# Altium schematic sheet Peripherals.SchDoc
size A4; Revision: C.2
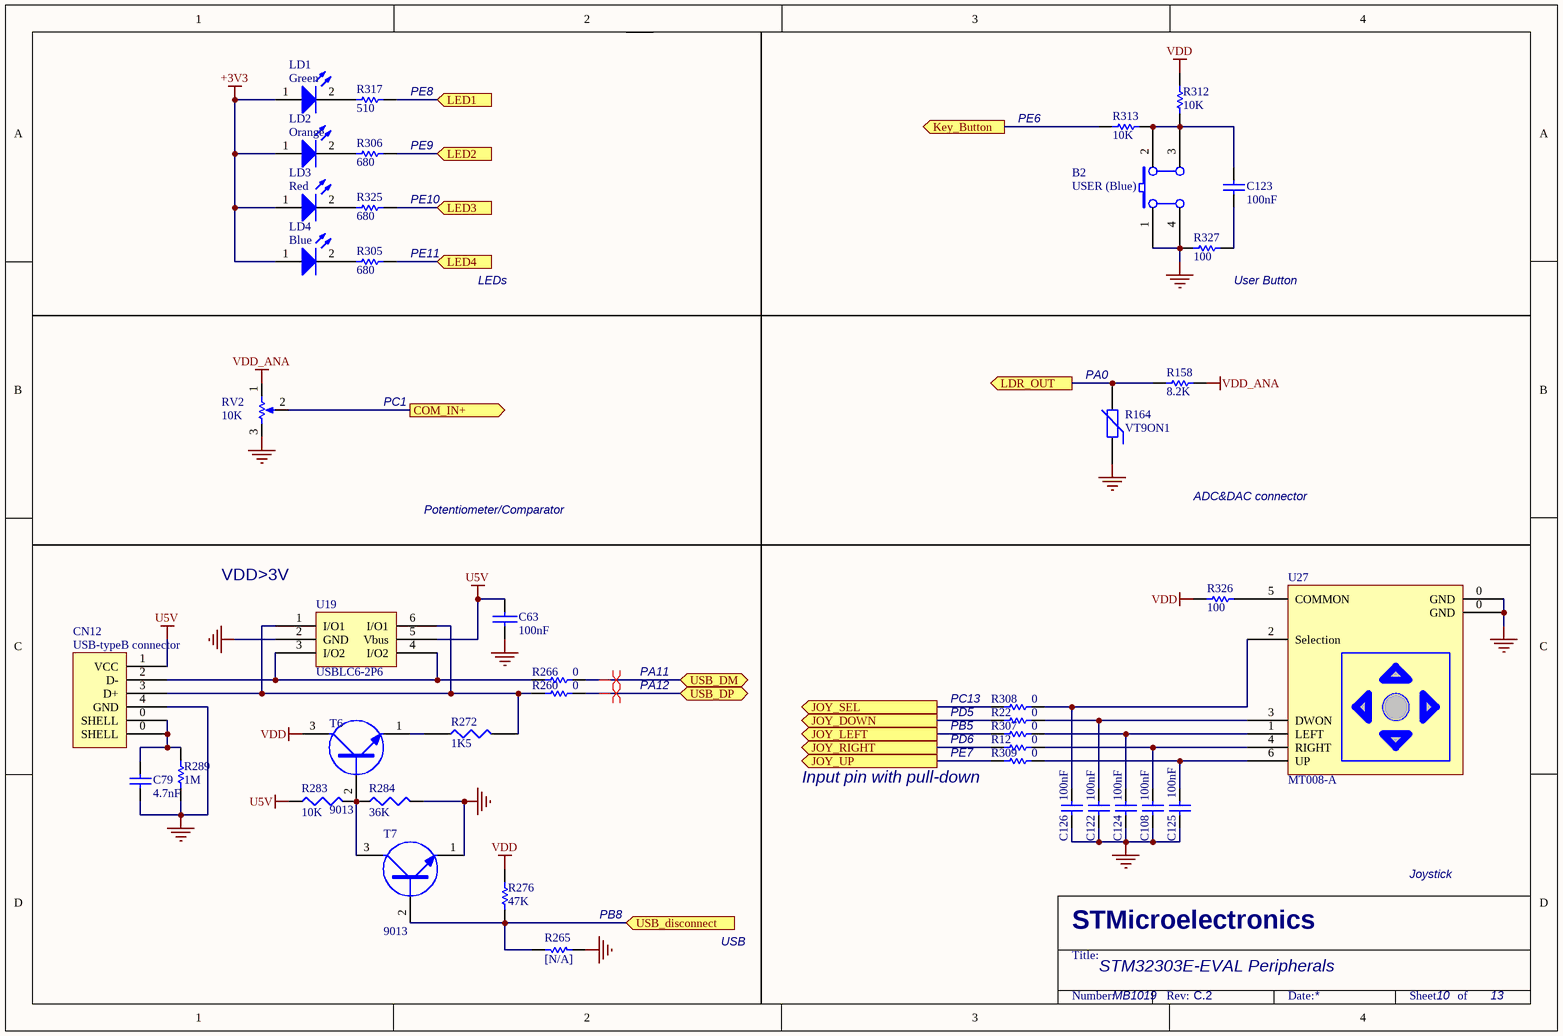
[diagram p0: Peripherals.SchDoc]

## Parts
B2  USER (Blue)  [PB10]
C63  100nF  [0603C]
C79  4.7nF  [0603C]
C108  100nF  [0603C]
C122  100nF  [0603C]
C123  100nF  [0603C]
C124  100nF  [0603C]
C125  100nF  [0603C]
C126  100nF  [0603C]
CN12  USB-typeB connector  [USB-B]
LD1  Green  [0603D]
LD2  Orange  [0603D]
LD3  Red  [0603D]
LD4  Blue  [0603D]
R12  0  [0603R]
R22  0  [0603R]
R158  8.2K  [0603R]
R164  VT9ON1  [PVT901]
R260  0  [0603R]
R265  [N/A]  [0603R]
R266  0  [0603R]
R272  1K5  [0603R]
R276  47K  [0603R]
R283  10K  [0603R]
R284  36K  [0603R]
R289  1M  [0603R]
R305  680  [0603R]
R306  680  [0603R]
R307  0  [0603R]
R308  0  [0603R]
R309  0  [0603R]
R312  10K  [0603R]
R313  10K  [0603R]
R317  510  [0603R]
R325  680  [0603R]
R326  100  [0603R]
R327  100  [0603R]
RV2  10K  [3296W]
T6  9013  [SOT-23]
T7  9013  [SOT-23]
U19  USBLC6-2P6  [SOT-666]
U27  MT008-A  [JOY]

## Ports
COM_IN+ (out), JOY_DOWN (out), JOY_LEFT (out), JOY_RIGHT (out), JOY_SEL (out), JOY_UP (out), Key_Button (out), LDR_OUT (out), LED1 (in), LED2 (in), LED3 (in), LED4 (in), USB_disconnect (in), USB_DM (bidir), USB_DP (bidir)

## Nets
+3V3: LD1.1(A) LD2.1(A) LD3.1(A) LD4.1(A)
GND: B2.1(A0) B2.4(A1) C63.2 C79.1 C108.1 C122.1 C124.1 C125.1 C126.1 CN12.4(GND) R164.1 R265.1 R284.2 R289.1 R327.1 RV2.3(TOP) T7.1(E) U19.2(GND) U27.0(GND)
U5V: C63.1 CN12.1(VCC) R283.1 U19.5(Vbus)
VDD: R276.2 R312.2 R326.1 T6.3(C)
VDD_ANA: R158.2 RV2.1(BOT)
COM_IN+: RV2.2(TAP) ; port COM_IN+
JOY_DOWN: R22.1 ; port JOY_DOWN
JOY_LEFT: R307.2 ; port JOY_LEFT
JOY_RIGHT: R12.1 ; port JOY_RIGHT
JOY_SEL: R308.2 ; port JOY_SEL
JOY_UP: R309.2 ; port JOY_UP
Key_Button: R313.2 ; port Key_Button
LDR_OUT: R158.1 R164.2 ; port LDR_OUT
LED1: R317.1 ; port LED1
LED2: R306.1 ; port LED2
LED3: R325.1 ; port LED3
LED4: R305.1 ; port LED4
USB_disconnect: R265.2 R276.1 T7.2(B) ; port USB_disconnect
USB_DM: R266.1 ; port USB_DM
USB_DP: R260.1 ; port USB_DP
NetB2_2: B2.2(B0) B2.3(B1) C123.2 R312.1 R313.1
NetC79_2: C79.2 CN12.0(SHELL) R289.2
NetC108_2: C108.2 R12.2 U27.4(RIGHT)
NetC122_2: C122.2 R22.2 U27.3(DWON)
NetC123_1: C123.1 R327.2
NetC124_2: C124.2 R307.1 U27.1(LEFT)
NetC125_2: C125.2 R309.1 U27.6(UP)
NetC126_2: C126.2 R308.1 U27.2(Selection)
NetCN12_2: CN12.2(D-) R266.2 U19.3(I/O2) U19.4(I/O2)
NetCN12_3: CN12.3(D+) R260.2 R272.2 U19.1(I/O1) U19.6(I/O1)
NetLD1_2: LD1.2(K) R317.2
NetLD2_2: LD2.2(K) R306.2
NetLD3_2: LD3.2(K) R325.2
NetLD4_2: LD4.2(K) R305.2
NetR272_1: R272.1 T6.1(E)
NetR283_2: R283.2 R284.1 T6.2(B) T7.3(C)
NetR326_2: R326.2 U27.5(COMMON)

## Layout directives
differential pair: USB_DM, USB_DP

## Notes on the sheet
- (near R317) PE8
- (near R306) PE9
- PE6
- (near R325) PE10
- (near R305) PE11
- LEDs
- (near R327) User Button
- (near R164) PA0
- PC1
- Potentiometer/Comparator
- ADC&DAC connector
- VDD>3V
- PA12
- PA11
- PD5
- PC13
- (near R309) Input pin with pull-down
- PE7
- PD6
- PB5
- (near R265) PB8
- Joystick
- USB
- STM32303E-EVAL Peripherals
- MB1019
- 10
- 13
- STMicroelectronics
- Title:
- Number:
- Rev:
- Date:
- Sheet       of

## Library data of the parts
B2 = SW PUSHBUTTON: SE PUSHBUTTON
C63 = CAP: Capacitor
C79 C108 C122-C126 = CAP: Capacitor; Value: 100pF; Published: 8-Jun-2000; Revision: July-2002: Re-released for DXP Platform.; Publisher: Altium Limited
CN12 = USB-B
LD1-LD4 = LED2: Typical RED, GREEN, YELLOW, AMBER GaAs LED; Published: 8-Jun-2000; Revision: July-2002: Re-released for DXP Platform.; Publisher: Altium Limited
R12 R22 R158 R260 R265 R266 R276 R289 R305-R309 R313 R317 R325-R327 = Res1: Resistor; Value: 1K; Published: 8-Jun-2000; Revision: July-2002: Re-released for DXP Platform.; Publisher: Altium Limited
R164 = Res Varistor: Varistor (Voltage-Sensitive Resistor); Published: 24-Mar-1999; Revision: July-2002: Re-released for DXP Platform.; Publisher: Altium Limited
R272 = RES1
R283 R284 = R: Right: 20; Bottom: 30
R312 = res1: Resistor; Value: 1K; Published: 8-Jun-2000; Revision: July-2002: Re-released for DXP Platform.; Publisher: Altium Limited
RV2 = RV
T6 T7 = NPN
U19 = USBLC6-2
U27 = MT-008A